# Altium schematic sheet PSU.SchDoc
size A; DocumentNumber: 3; SheetNumber: 3; SheetTotal: 4; PageSetup: Record=PageOptions|CenterHorizontal=True|CenterVertical=True|PrintScale=1.00|XCorrection=1.00|YCorrection=1.00|PrintKind=1|BorderSize=5000000|LeftOffset=0|BottomOffset=0|Orientation=2|PaperLength=1000|PaperWidth=1000|Scale=100|PaperSource=7|PrintQuality=-3|MediaType=1|DitherType=10|PrintScaleMode=1|PaperKind=A4|PaperIndex=9
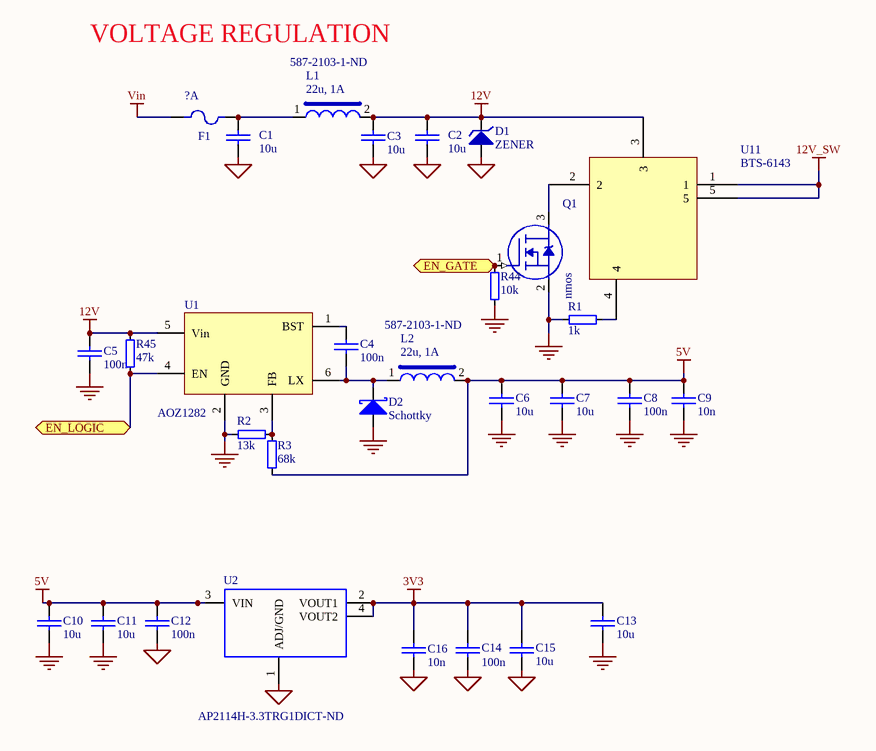
[diagram p0: PSU.SchDoc]

## Parts
C1  10u  [0805]
C2  10u  [0805]
C3  10u  [0805]
C4  100n  [0603]
C5  100n  [0603]
C6  10u  [0805]
C7  10u  [0805]
C8  100n  [0603]
C9  10n  [0603]
C10  10u  [0805]
C11  10u  [0805]
C12  100n  [0603]
C13  10u  [0805]
C14  100n  [0603]
C15  10u  [0805]
C16  10n  [0603]
D1  ZENER  [DO214AC]
D2  Schottky  [DO214AC]
F1  ?A  [1206]
L1  22u, 1A  Supplier Part Number 1: 587-2103-1-ND  [2220]
L2  22u, 1A  Supplier Part Number 1: 587-2103-1-ND  [2220]
Q1  nmos  [SOT23]
R1  1k  [0603]
R2  13k  [0603]
R3  68k  [0603]
R44  10k  [0603]
R45  47k  [0805]
U1  AOZ1282  [SOT23-6]
U2  AP2114H-3.3TRG1DICT-ND  [SOT223]
U11  BTS-6143  [TO252-5-11]

## Ports
EN_GATE, EN_LOGIC

## Nets
3V3: C13.2 C14.1 C15.1 C16.1 U2.2(VOUT1) U2.4(VOUT2)
5V: C6.2 C7.2 C8.1 C9.1 C10.2 C11.2 C12.1 L2.2 R3.1 U2.3(VIN)
12V: C2.1 C3.1 C5.1 D1.K L1.2 R45.1 U1.5(Vin) U11.3
12V_SW: U11.1 U11.5
GND: C1.2 C2.2 C3.2 C5.2 C6.1 C7.1 C8.2 C9.2 C10.1 C11.1 C12.2 C13.1 C14.2 C15.2 C16.2 D1.A D2.A Q1.2(S) R1.1 R2.1 R44.2 U1.2(GND) U2.1(ADJ/GND)
Vin: F1.1
EN_GATE: Q1.1(G) R44.1 ; port EN_GATE
EN_LOGIC: R45.2 U1.4(EN) ; port EN_LOGIC
NetC1_1: C1.1 F1.2 L1.1
NetC4_1: C4.1 D2.K L2.1 U1.6(LX)
NetC4_2: C4.2 U1.1(BST)
NetQ1_3: Q1.3(D) U11.2
NetR1_2: R1.2 U11.4
NetR2_2: R2.2 R3.2 U1.3(FB)

## Notes on the sheet
- VOLTAGE REGULATION

## Library data of the parts
C1-C3 C12 C15 = CAP: Capacitor; Status: Draft
C4 C5 C8 C9 = CAP: Manufacturer 1: Murata GRM188R71H104KA93D; Parameter: 100n, 0603, 50V, <20%, X7R Ceramic; Digikey Part Number: PCC2153CT-ND; Manufacturer 2: TDK C1608X7R1H104K; Manufacturer 3: AVX 06035C104KAT2A; Manufacturer 5: Yageo CC0603KRX7R9BB104; Manufacturer 4: Kemet C0603C104J5RACTU-ND
C6 C7 C10 C11 C13 = CAP: Capacitor; Parameter: 10uF, 0805, =>6.3V, <=10%, X5R Ceramic
C14 = CAP: Manufacturer 1: Murata GCM188R71C474KA55D; Parameter: 470n, 0603, >=16V, <20%, X7R Ceramic; Digikey Part Number: 490-4775-1-ND; Manufacturer 2: Taiyo EMK107B7474KA-T; Manufacturer 3: Kemet C0603C474K4RACTU, C0603C474K4RAC; Manufacturer 4: TDK C1608X7R1C474M
C16 = CAP: Manufacturer 1: Murata GRM188R71H103KA01D; Parameter: 10n, 0603, 50V, <20%, X7R Ceramic; Digikey Part Number: PCC2153CT-ND; Manufacturer 2: AVX	06035C103KAT2A; Manufacturer 3: TDK  C1608X7R1H103J
D1 = ZENER: Zener Diode; Manufacturer 1: *; Manufacturer 2: *; Manufacturer 3: *; Parameter: *; Status: Draft
D2 = DIODE SCHOTTKY: Schottky Diode; Manufacturer 1: Micro Commercial Co SD103AWS-TP; Parameter: DIODE SHOTTKY >30V >0.2A; Digikey Part Number: SD103AWSTPMSCT-ND; Status: Draft
F1 = FUSE: Thermal Fuse
L1 L2 = INDUCTOR-1 COIL: Standard single coil inductor; Parameter: INDUCTOR 22uH >1A 1210; Manufacturer 2: *; Manufacturer 3: *; Status: Draft; Supplier 1: Digi-Key
Q1 = MOSFET-N: N-Channel MOSFET; Manufacturer 1: *; Manufacturer 2: *; Manufacturer 3: *; Parameter: *; Status: Draft
R1-R3 R45 = RESISTOR: Parameter: <1%, Thick film, 63mW; Status: Draft
R44 = RES4: Parameter: 1%, Thick or Metal Film, 63mW
U1 = AOZ1280: Manufacturer 1: Alpha & Omega AOZ1282CI; Parameter: 1.2A, 4.5V-36V input, 450KHz; Digikey Part Number: 785-1613-1-ND
U2 = TLV1117-33